# Altium schematic sheet Reader.SchDoc
size A2
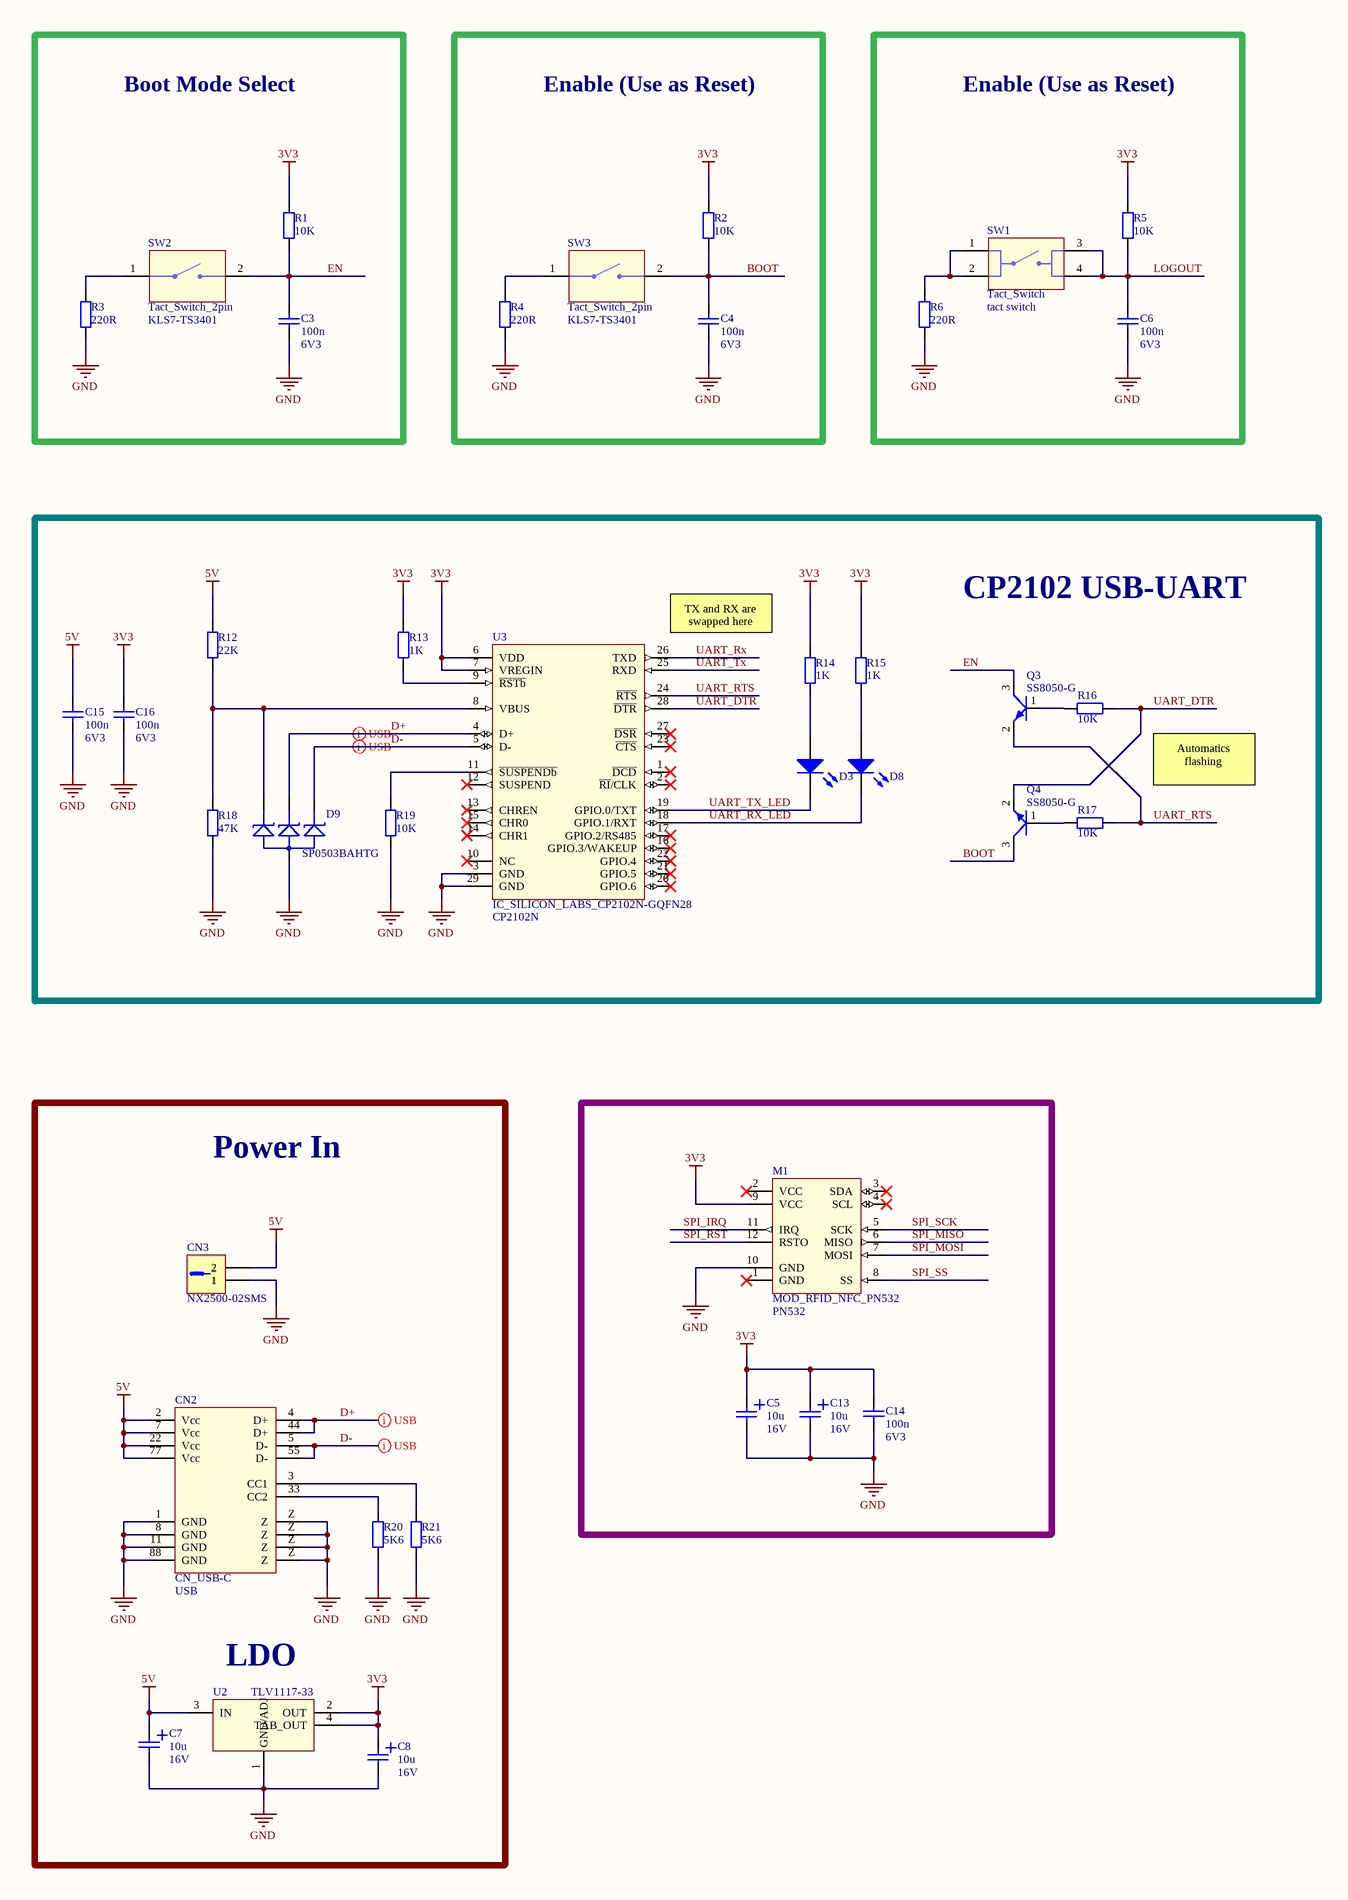
[diagram p0: Reader.SchDoc, left]
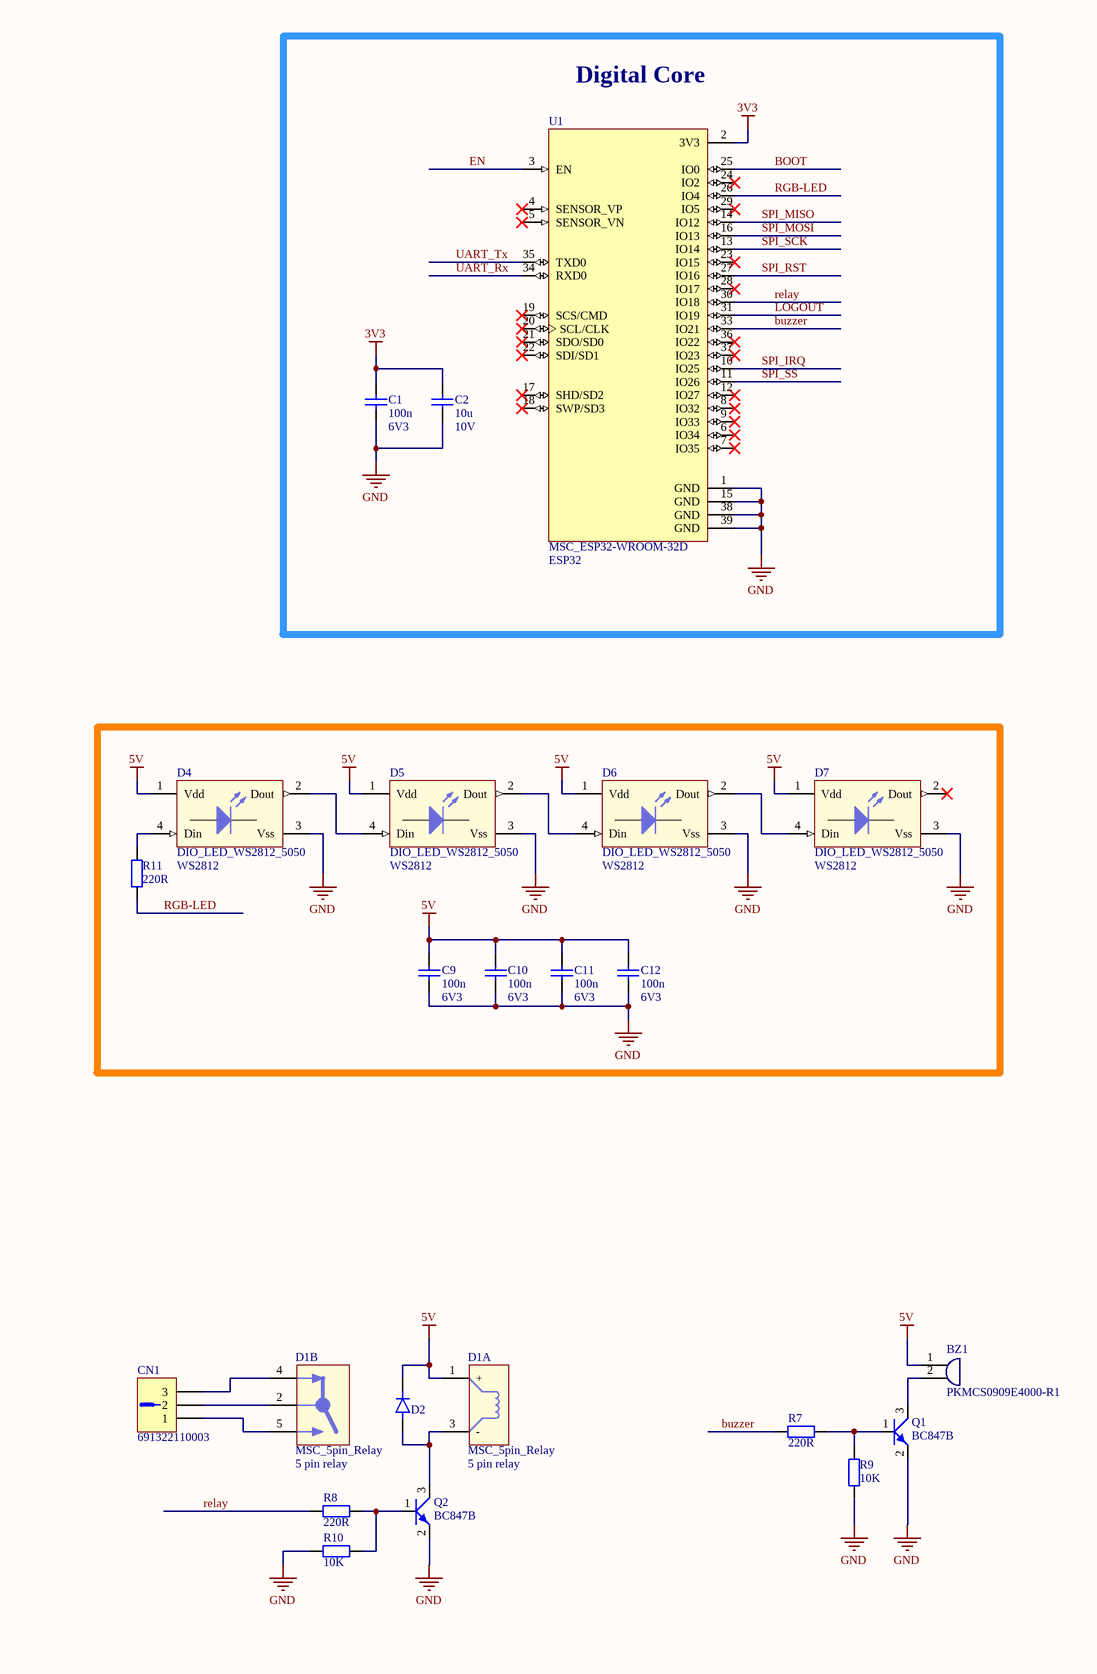
[diagram p1: Reader.SchDoc, right]

## Parts
BZ1  Value1: PKMCS0909E4000-R1  [MSC_MURATA_PKMCS0909E4000-R1]  (hidden comment: MSC_BUZZER)
C1  Value1: 100n  Value2: 6V3  [CAPC1608X87N]  (hidden comment: CAP)
C2  Value1: 10u  Value2: 10V  [CAPC1608X87N]  (hidden comment: CAP)
C3  Value1: 100n  Value2: 6V3  [CAPC1608X87N]  (hidden comment: CAP)
C4  Value1: 100n  Value2: 6V3  [CAPC1608X87N]  (hidden comment: CAP)
C5  Value1: 10u  Value2: 16V  [CAPM3528x210_N]  (hidden comment: CAP_POL)
C6  Value1: 100n  Value2: 6V3  [CAPC1608X87N]  (hidden comment: CAP)
C7  Value1: 10u  Value2: 16V  [CAPM3528x210_N]  (hidden comment: CAP_POL)
C8  Value1: 10u  Value2: 16V  [CAPM3528x210_N]  (hidden comment: CAP_POL)
C9  Value1: 100n  Value2: 6V3  [CAPC1608X87N]  (hidden comment: CAP)
C10  Value1: 100n  Value2: 6V3  [CAPC1608X87N]  (hidden comment: CAP)
C11  Value1: 100n  Value2: 6V3  [CAPC1608X87N]  (hidden comment: CAP)
C12  Value1: 100n  Value2: 6V3  [CAPC1608X87N]  (hidden comment: CAP)
C13  Value1: 10u  Value2: 16V  [CAPM3528x210_N]  (hidden comment: CAP_POL)
C14  Value1: 100n  Value2: 6V3  [CAPC1608X87N]  (hidden comment: CAP)
C15  Value1: 100n  Value2: 6V3  [CAPC1608X87N]  (hidden comment: CAP)
C16  Value1: 100n  Value2: 6V3  [CAPC1608X87N]  (hidden comment: CAP)
CN1  Value1: 691322110003  [CN_Wurth_691322110003]  (hidden comment: CN_1X3M)
CN2  CN_USB-C  Value1: USB  [CN_USB-C_vertical]
CN3  Value1: NX2500-02SMS  [CN_XH2.54-2P-MALE]  (hidden comment: CN_1X2M)
D1  MSC_5pin_Relay  Value1: 5 pin relay  [MSC_SRD-12VDC-SL-C]  (parts A,B of 2)
D2  DIO  [DO-214AC]  (value not drawn)
D3  DIO_LED  [DIO_RED_0603]  (value not drawn)
D4  DIO_LED_WS2812_5050  Value1: WS2812  [DIO_LED_WORLDSEMI_WS2812B]
D5  DIO_LED_WS2812_5050  Value1: WS2812  [DIO_LED_WORLDSEMI_WS2812B]
D6  DIO_LED_WS2812_5050  Value1: WS2812  [DIO_LED_WORLDSEMI_WS2812B]
D7  DIO_LED_WS2812_5050  Value1: WS2812  [DIO_LED_WORLDSEMI_WS2812B]
D8  DIO_LED  [DIO_RED_0603]  (value not drawn)
D9  Value1: SP0503BAHTG  [SOT143-L]  (hidden comment: DIO_TVS_THREE)
M1  MOD_RFID_NFC_PN532  Value1: PN532  [MOD_RFID_NFC_PN532_no3d]
Q1  Value1: BC847B  [SOT23]  (hidden comment: TRS_NPN_123)
Q2  Value1: BC847B  [SOT23]  (hidden comment: TRS_NPN_123)
Q3  Value1: SS8050-G  [SOT23]  (hidden comment: TRS_NPN_123)
Q4  Value1: SS8050-G  [SOT23]  (hidden comment: TRS_NPN_123)
R1  Value1: 10K  [RESC1608X55N]  (hidden comment: RES)
R2  Value1: 10K  [RESC1608X55N]  (hidden comment: RES)
R3  Value1: 220R  [RESC1608X55N]  (hidden comment: RES)
R4  Value1: 220R  [RESC1608X55N]  (hidden comment: RES)
R5  Value1: 10K  [RESC1608X55N]  (hidden comment: RES)
R6  Value1: 220R  [RESC1608X55N]  (hidden comment: RES)
R7  Value1: 220R  [RESC1608X55N]  (hidden comment: RES)
R8  Value1: 220R  [RESC1608X55N]  (hidden comment: RES)
R9  Value1: 10K  [RESC1608X55N]  (hidden comment: RES)
R10  Value1: 10K  [RESC1608X55N]  (hidden comment: RES)
R11  Value1: 220R  [RESC1608X55N]  (hidden comment: RES)
R12  Value1: 22K  [RESC1608X55N]  (hidden comment: RES)
R13  Value1: 1K  [RESC1608X55N]  (hidden comment: RES)
R14  Value1: 1K  [RESC1608X55N]  (hidden comment: RES)
R15  Value1: 1K  [RESC1608X55N]  (hidden comment: RES)
R16  Value1: 10K  [RESC1608X55N]  (hidden comment: RES)
R17  Value1: 10K  [RESC1608X55N]  (hidden comment: RES)
R18  Value1: 47K  [RESC1608X55N]  (hidden comment: RES)
R19  Value1: 10K  [RESC1608X55N]  (hidden comment: RES)
R20  Value1: 5K6  [RESC1608X55N]  (hidden comment: RES)
R21  Value1: 5K6  [RESC1608X55N]  (hidden comment: RES)
SW1  Tact_Switch  Value1: tact switch  [Tact_Switch_SMD]
SW2  Tact_Switch_2pin  Value1: KLS7-TS3401  [MSC_KLS7-TS3401]
SW3  Tact_Switch_2pin  Value1: KLS7-TS3401  [MSC_KLS7-TS3401]
U1  MSC_ESP32-WROOM-32D  Value1: ESP32  [MSC_ESP32-WROOM-32D]
U2  Value1: TLV1117-33  [SOT230P730X180-4N]  (hidden comment: IC_TI_LM1117)
U3  IC_SILICON_LABS_CP2102N-GQFN28  Value1: CP2102N  [QFN-28N]

## Blocks framed on the sheet
Boot Mode Select: C3 R1 R3 SW2
Enable (Use as Reset): C4 R2 R4 SW3
Enable (Use as Reset): C6 R5 R6 SW1
Digital Core: C1 C2 U1
CP2102 USB-UART: C15 C16 D3 D8 D9 Q3 Q4 R12-R19 U3

## Nets
3V3: C1.2 C2.2 C5.1 C8.1 C13.1 C14.2 C16.2 M1.9(VCC) R1.2 R2.2 R5.2 R13.2 R14.2 R15.2 U1.2(3V3) U2.2(OUT) U2.4(TAB_OUT) U3.6(VDD) U3.7(VREGIN)
5V: BZ1.1 C7.1 C9.2 C10.2 C11.2 C12.2 C15.2 CN2.2(Vcc) CN2.7(Vcc) CN2.22(Vcc) CN2.77(Vcc) CN3.2 D1.1(+) D2.1(K) D4.1(Vdd) D5.1(Vdd) D6.1(Vdd) D7.1(Vdd) R12.2 U2.3(IN)
GND: C1.1 C2.1 C3.1 C4.1 C5.2 C6.1 C7.2 C8.2 C9.1 C10.1 C11.1 C12.1 C13.2 C14.1 C15.1 C16.1 CN2.1(GND) CN2.8(GND) CN2.11(GND) CN2.88(GND) CN2.Z CN3.1 D4.3(Vss) D5.3(Vss) D6.3(Vss) D7.3(Vss) D9.1(Anode) M1.10(GND) Q1.2(E) Q2.2(E) R3.1 R4.1 R6.1 R9.1 R10.1 R18.1 R19.1 R20.1 R21.1 U1.1(GND) U1.15(GND) U1.38(GND) U1.39(GND) U2.1(GND/ADJ) U3.3(GND) U3.29(GND)
BOOT: C4.2 Q4.3(C) R2.1 SW3.2 U1.25(IO0)
buzzer: R7.1 U1.33(IO21)
D+: CN2.4(D+) CN2.44(D+) D9.3(Cathode) U3.4(D+)
D-: CN2.5(D-) CN2.55(D-) D9.4(Cathode) U3.5(D-)
EN: C3.2 Q3.3(C) R1.1 SW2.2 U1.3(EN)
LOGOUT: C6.2 R5.1 SW1.3 SW1.4 U1.31(IO19)
relay: R8.1 U1.30(IO18)
RGB-LED: R11.1 U1.26(IO4)
SPI_IRQ: M1.11(IRQ) U1.10(IO25)
SPI_MISO: M1.6(MISO) U1.14(IO12)
SPI_MOSI: M1.7(MOSI) U1.16(IO13)
SPI_RST: M1.12(RSTO) U1.27(IO16)
SPI_SCK: M1.5(SCK) U1.13(IO14)
SPI_SS: M1.8(SS) U1.11(IO26)
UART_DTR: Q4.2(E) R16.1 U3.28(~{DTR})
UART_RTS: Q3.2(E) R17.1 U3.24(~{RTS})
UART_Rx: U1.34(RXD0) U3.26(TXD)
UART_RX_LED: D8.1(K) U3.18(GPIO.1/RXT)
UART_Tx: U1.35(TXD0) U3.25(RXD)
UART_TX_LED: D3.1(K) U3.19(GPIO.0/TXT)
NetBZ1_2: BZ1.2 Q1.3(C)
NetCN1_1: CN1.1 D1.5
NetCN1_2: CN1.2 D1.2
NetCN1_3: CN1.3 D1.4
NetCN2_3: CN2.3(CC1) R21.2
NetCN2_33: CN2.33(CC2) R20.2
NetD1_3: D1.3(-) D2.2(A) Q2.3(C)
NetD3_2: D3.2(A) R14.1
NetD4_2: D4.2(Dout) D5.4(Din)
NetD4_4: D4.4(Din) R11.2
NetD5_2: D5.2(Dout) D6.4(Din)
NetD6_2: D6.2(Dout) D7.4(Din)
NetD8_2: D8.2(A) R15.1
NetD9_2: D9.2(Cathode) R12.1 R18.2 U3.8(VBUS)
NetQ1_1: Q1.1(B) R7.2 R9.2
NetQ2_1: Q2.1(B) R8.2 R10.2
NetQ3_1: Q3.1(B) R16.2
NetQ4_1: Q4.1(B) R17.2
NetR3_2: R3.2 SW2.1
NetR4_2: R4.2 SW3.1
NetR6_2: R6.2 SW1.1 SW1.2
NetR13_1: R13.1 U3.9(~{RSTb})
NetR19_2: R19.2 U3.11(~{SUSPENDb})

Not connected (* = marked no-connect by the designer): D7 2(Dout)*; M1 1(GND)* 2(VCC)* 3(SDA)* 4(SCL)*; U1 4(SENSOR_VP)* 5(SENSOR_VN)* 6(IO34)* 7(IO35)* 8(IO32)* 9(IO33)* 12(IO27)* 17(SHD/SD2)* 18(SWP/SD3)* 19(SCS/CMD)* 20(SCL/CLK)* 21(SDO/SD0)* 22(SDI/SD1)* 23(IO15)* 24(IO2)* 28(IO17)* 29(IO5)* 36(IO22)* 37(IO23)*; U3 1(~{DCD})* 2(~{RI}/CLK)* 10(NC)* 12(SUSPEND)* 13(CHREN)* 14(CHR1)* 15(CHR0)* 16(GPIO.3/WAKEUP)* 17(GPIO.2/RS485)* 20(GPIO.6)* 21(GPIO.5)* 22(GPIO.4)* 23(~{CTS})* 27(~{DSR})*

## Layout directives
differential pair: D+, D-

## Notes on the sheet
- TX and RX are swapped here
- Automatics flashing
- Power In
- (near U2) LDO

## Library data of the parts
BZ1 = 12_00160: Piezo Buzzers & Audio Indicators 65 DB 4.0 KHZ; Manufacturer PN: Murata; AutoId: 171; Value2: 65DB 4KHz; DeviceType: misc; Id: 12_00160; Status: 0 - Unchecked; MountType: SMT; ComponentLink1Description: Datasheet; ComponentLink1URL: X:\01_Datasheets\MSC_MURATA_PKMCS0909E4000-R1.pdf; ComponentLink2Description: ComponentVerificationSheet; ComponentLink2URL: X:\02_ComponentVerificationSheets\; Supplier 1: Mouser; Supplier Part Number 1: 81-PKMCS0909E4000-R1
C1 C3 C4 C6 C9-C12 C14-C16 = 01_00282: X7R 10% 0603; Manufacturer: KEMET; Manufacturer PN: C0603C104K9RACTU; AutoId: 282; DeviceType: capacitor; SubType: Ceramic; Id: 01_00282; Status: 2 - Checked and Approved; MountType: SMT; ComponentLink1URL: X:\01_Datasheets\CAP_KEMET_CxxxxCxxxXxRAC.pdf; Supplier 1: Farnell; Supplier Part Number 1: 80-C0603C104K9R; ComponentLink1Description: Datasheet
C2 = 01_01407: X7R 10% 0603; Manufacturer: TAIYO YUDEN; Manufacturer PN: LMK107BJ106MALTD; AutoId: 1407; DeviceType: capacitor; SubType: Ceramic; Id: 01_01407; Status: 2 - Checked and Approved; MountType: SMD; ComponentLink1URL: X:\01_dataSheets\CAP_TAIYO_YUDEN_TMK325BJXXXMN-T.pdf; Supplier 1: Farnell; Supplier Part Number 1: 2113070; ComponentLink1Description: Datasheet
C5 C7 C8 C13 = 01_01418: Tantalum, 10%, 3225; Manufacturer: AVX; Manufacturer PN: TAJB106K016RNJ; AutoId: 1418; DeviceType: capacitor; Id: 01_01418; SubType: Tantalum; Status: 0 - Unchecked; MountType: SMT; ComponentLink1URL: X:\01_Datasheets\; Supplier 1: Farnell; Supplier Part Number 1: 498737; ComponentLink1Description: Datasheet
CN1 = 02_10131: Pluggable Terminal Blocks WR-TBL 300VAC 10A 3P Right Angle; Manufacturer: Wurth; AutoId: 172; Value2: 3 pin; Value3: 3.5mm; DeviceType: Connector_; Id: 02_10131; Manufacturer PN: 691322110003; MountType: THT; ComponentLink1Description: Datasheet; ComponentLink1URL: X:\01_Datasheets\; ComponentLink2Description: ComponentVerificationSheet; ComponentLink2URL: X:\02_ComponentVerificationSheets\; Supplier 1: Mouser; Supplier Part Number 1: 710-691322110003
CN2 = 02_10129: AutoId: 170; Value2: type-c; Value3: 9mm; DeviceType: Connector_; Id: 02_10129; MountType: THT; ComponentLink1Description: Datasheet; ComponentLink1URL: X:\01_Datasheets\CN_USB-C_vertical.pdf; ComponentLink2Description: ComponentVerificationSheet; ComponentLink2URL: X:\02_ComponentVerificationSheets\
CN3 = 02_10135: Manufacturer: Joint Tech; Manufacturer PN: A2501WV-2P; AutoId: 176; Value2: 2 pin; Value3: 2.54mm; DeviceType: Connector_; Id: 02_10135; MountType: SMT; ComponentLink1Description: Datasheet; ComponentLink1URL: X:\01_Datasheets\; ComponentLink2Description: ComponentVerificationSheet; ComponentLink2URL: X:\02_ComponentVerificationSheets\
D1 = 12_00134: Manufacturer: SRD; Manufacturer PN: SRD-05VDC-SL-C; AutoId: 133; Value2: relay; Value3: 5V; DeviceType: misc; Id: 12_00134; Status: 0 - Unchecked; MountType: SMT; ComponentLink1Description: Datasheet; ComponentLink1URL: X:\01_Datasheets\MSC_SRD-12VDC-SL-C.pdf; ComponentLink2Description: ComponentVerificationSheet; ComponentLink2URL: X:\02_ComponentVerificationSheets\
D2 = DIO_SS16
D3 D8 = 03_00075: Standard LEDs - SMD WL-SMCW SMDMono TpVw Waterclr 0603 Red; Manufacturer: Wurth Electronics; Manufacturer PN: 150060RS75000; AutoId: 75; Value2: 2V 20mA; DeviceType: diode; SubType: LED; Id: 03_00075; Value1: Red; Status: 0 - Unchecked; MountType: SMD; ComponentLink1Description: Datasheet; ComponentLink1URL: X:\01_Datasheets\DIO_WE_WL-SMCW_SMD_LED.pdf; ComponentLink2Description: ComponentVerificationSheet; ComponentLink2URL: X:\02_ComponentVerificationSheets\; Supplier 1: Mouser; Supplier Part Number 1: 710-150060RS75000
D4-D7 = 03_00096: RGB 5050 address; Manufacturer: WORLDSEMI; Manufacturer PN: WS2812B; AutoId: 112; Value2: 3,7...5,3 V; Value3: 620/515/465 nm; DeviceType: diode; Id: 03_00096; MountType: SMD; ComponentLink1Description: Datasheet; ComponentLink1URL: X:\01_Datasheets\; ComponentLink2Description: ComponentVerificationSheet; ComponentLink2URL: X:\02_ComponentVerificationSheets\; Supplier 1: rcs; Supplier Part Number 1: 168190
D9 = 03_00097: ESD Suppressors / TVS Diodes TVS AVAL DIODE SMT; Manufacturer: Littelfuse; AutoId: 113; Value2: TVS USB; Value3: 30kV; Id: 03_00097; Manufacturer PN: SP0503BAHTG; DeviceType: diode; Status: 0 - Unchecked; MountType: SMD; ComponentLink1Description: Datasheet; ComponentLink1URL: X:\01_Datasheets\DIO_Littlefuse_SP0503BAHTG.pdf; ComponentLink2Description: ComponentVerificationSheet; ComponentLink2URL: X:\02_ComponentVerificationSheets\; Supplier 1: Mouser; Supplier Part Number 1: 576-SP0503BAHTG
M1 = 12_00155: AutoId: 166; Value2: RFID NFC; DeviceType: misc; Id: 12_00155; Manufacturer PN: PN532; MountType: THD; ComponentLink1Description: Datasheet; ComponentLink1URL: X:\01_Datasheets\; ComponentLink2Description: ComponentVerificationSheet; ComponentLink2URL: X:\02_ComponentVerificationSheets\
Q1 Q2 = 19_00039: Bipolar Transistors - BJT NPN 45V 100mA; Manufacturer: NXP; Manufacturer PN: BC847B,215; AutoId: 39; Value2: 45V 0,1A; Id: 19_00039; DeviceType: transistor; SubType: NPN; Status: 0 - Unchecked; MountType: SMD; ComponentLink1Description: Datasheet; ComponentLink1URL: X:\01_Datasheets\TRS_NXP_BC847.pdf; ComponentLink2Description: ComponentVerificationSheet; ComponentLink2URL: X:\02_ComponentVerificationSheets\; Supplier 1: Mouser; Supplier Part Number 1: 771-BC847B-T/R
Q3 Q4 = 19_00046: Bipolar Transistors - BJT NPN TRANSISTOR 1.5A 40V; Manufacturer: Comchip; AutoId: 52; Value2: 40V 1,5A; Id: 19_00046; Manufacturer PN: SS8050-G; DeviceType: transistor; SubType: NPN; Status: 0 - Unchecked; MountType: SMT; ComponentLink1Description: Datasheet; ComponentLink1URL: X:\01_Datasheets\; ComponentLink2Description: ComponentVerificationSheet; ComponentLink2URL: X:\02_ComponentVerificationSheets\; Supplier 1: Mouser; Supplier Part Number 1: 750-SS8050-G
R1 R2 R5 R9 R10 R16 R17 R19 = 15_00268: RESISTOR, 0603, 01K, 1%, SMD; Manufacturer: Yageo; Manufacturer PN: RC0603FR-0710K; AutoId: 268; Value2: 0W1; SubType: Metal film; Id: 15_00268; DeviceType: resistor; Status: 2 - Checked and Approved; MountType: SMT; ComponentLink1Description: Datasheet; ComponentLink1URL: X:\01_Datasheets\RES_YAGEO_RC0603FR.pdf; Supplier 1: Farnell; Supplier Part Number 1: 9238603
R3 R4 R6-R8 R11 = 15_00248: RESISTOR, 0603, 220R, 1%, SMD; Manufacturer: Yageo; Manufacturer PN: RC0603FR-07220R; AutoId: 248; Value2: 0W1; SubType: Metal film; Id: 15_00248; DeviceType: resistor; Status: 2 - Checked and Approved; MountType: SMT; ComponentLink1Description: Datasheet; ComponentLink1URL: X:\01_Datasheets\RES_YAGEO_RC0603FR.pdf; Supplier 1: Farnell; Supplier Part Number 1: 9238409
R12 = 15_00272: RESISTOR, 0603, 22K, 1%, SMD; Manufacturer: Yageo; Manufacturer PN: RC0603FR-0722K; AutoId: 272; Value2: 0W1; SubType: Metal film; Id: 15_00272; DeviceType: resistor; Status: 2 - Checked and Approved; MountType: SMT; ComponentLink1Description: Datasheet; ComponentLink1URL: X:\01_Datasheets\RES_YAGEO_RC0603FR.pdf; Supplier 1: Farnell; Supplier Part Number 1: 9238646
R13-R15 = 15_00256: RESISTOR, 0603, 1K, 1%, SMD; Manufacturer: Yageo; Manufacturer PN: RC0603FR-071K; AutoId: 256; Value2: 0W1; SubType: Metal film; Id: 15_00256; DeviceType: resistor; Status: 2 - Checked and Approved; MountType: SMD; ComponentLink1Description: Datasheet; ComponentLink1URL: X:\01_Datasheets\RES_YAGEO_RC0603FR.pdf; Supplier 1: Farnell; Supplier Part Number 1: 9238484RL
R18 = 15_00276: RESISTOR, 0603, 47K, 1%, SMD; Manufacturer: Yageo; Manufacturer PN: RC0603FR-0747K; AutoId: 276; Value2: 0W1; SubType: Metal film; Id: 15_00276; DeviceType: resistor; Status: 2 - Checked and Approved; MountType: SMT; ComponentLink1Description: Datasheet; ComponentLink1URL: X:\01_Datasheets\RES_YAGEO_RC0603FR.pdf; Supplier 1: Farnell; Supplier Part Number 1: 9238689
R20 R21 = 15_00265: RESISTOR, 0603, 5K6, 1%, SMD; Manufacturer: Yageo; Manufacturer PN: RC0603FR-075K6; AutoId: 265; Value2: 0W1; SubType: Metal film; Id: 15_00265; DeviceType: resistor; Status: 2 - Checked and Approved; MountType: SMT; ComponentLink1Description: Datasheet; ComponentLink1URL: X:\01_Datasheets\RES_YAGEO_RC0603FR.pdf; Supplier 1: Farnell; Supplier Part Number 1: 9238573
SW1 = 12_00117: AutoId: 117; DeviceType: misc; Id: 12_00117; Status: 0 - Unchecked; ComponentLink1Description: Datasheet; ComponentLink1URL: X:\01_Datasheets\; ComponentLink2Description: ComponentVerificationSheet; ComponentLink2URL: X:\02_ComponentVerificationSheets\
SW2 SW3 = 12_00156: Tactile switch SMD; Manufacturer: KLS; AutoId: 167; DeviceType: misc; Id: 12_00156; Value2: switch; Manufacturer PN: KLS7-TS3401; MountType: SMT; ComponentLink1Description: Datasheet; ComponentLink1URL: X:\01_Datasheets\KLS7-TS3401.pdf; ComponentLink2Description: ComponentVerificationSheet; ComponentLink2URL: X:\02_ComponentVerificationSheets\; Supplier 1: Imrad; Supplier Part Number 1: 45632
U1 = 12_10065: Bluetooth, WiFi 802.11b/g/n, Bluetooth v4.2 + EDR, Class 1, 2 and 3 Transceiver Module 2.4GHz ~ 2.5GHz Integrated, Trace Surface Mount; Manufacturer: Espressif; AutoId: 143; Value2: WROOM; DeviceType: misc; Id: 12_10065; Manufacturer PN: ESP32; Status: 0 - Unchecked; MountType: SMT; ComponentLink1Description: Datasheet; ComponentLink1URL: X:\01_Datasheets\; ComponentLink2Description: ComponentVerificationSheet; ComponentLink2URL: X:\02_ComponentVerificationSheets\
U2 = 07_00026: IC, LDO VOLT REG, 3V3, 0.8A, SOT-223-4; Manufacturer: Texas Instruments; Manufacturer PN: TLV1117-33IDCY; AutoId: 26; Value2: LDO, 3V3, 0.8A; SubType: Linear Regulator; Id: 07_00026; DeviceType: TLV1117-33IDCY; Status: 2 - Checked and Approved; MountType: SMD; ComponentLink1Description: Datasheet; ComponentLink1URL: X:\01_Datasheets\IC_TI_TLV1117-XX.pdf; ComponentLink2Description: ComponentVerificationSheet; ComponentLink2URL: X:\02_ComponentVerificationSheets\IC_TI_TLV1117-33_ComponentVerificationSheet.xlsx; Supplier 1: Farnell; Supplier Part Number 1: 1703385
U3 = 07_00292: USB Interface IC USBXpress - USB to UART Bridge QFN28; Manufacturer: Silicon Labs; Manufacturer PN: CP2102N-A02-GQFN28; AutoId: 299; Value2: 28pin QFN-28; Value3: 3 Mb/s; Id: 07_00292; DeviceType: IC; Status: 0 - Unchecked; MountType: SMT; ComponentLink1Description: Datasheet; ComponentLink1URL: X:\01_Datasheets\IC_SILICON_LABS_CP2102.pdf; ComponentLink2Description: ComponentVerificationSheet; ComponentLink2URL: X:\02_ComponentVerificationSheets\; Supplier 1: Mouser; Supplier Part Number 1: 634-CP2102NA02GQFN28